# Altium schematic sheet I2C Multiplexer.SchDoc: I2C Multiplexer
size 292 x 193 mm; DocumentNumber: 50; SheetNumber: 39; SheetTotal: 44
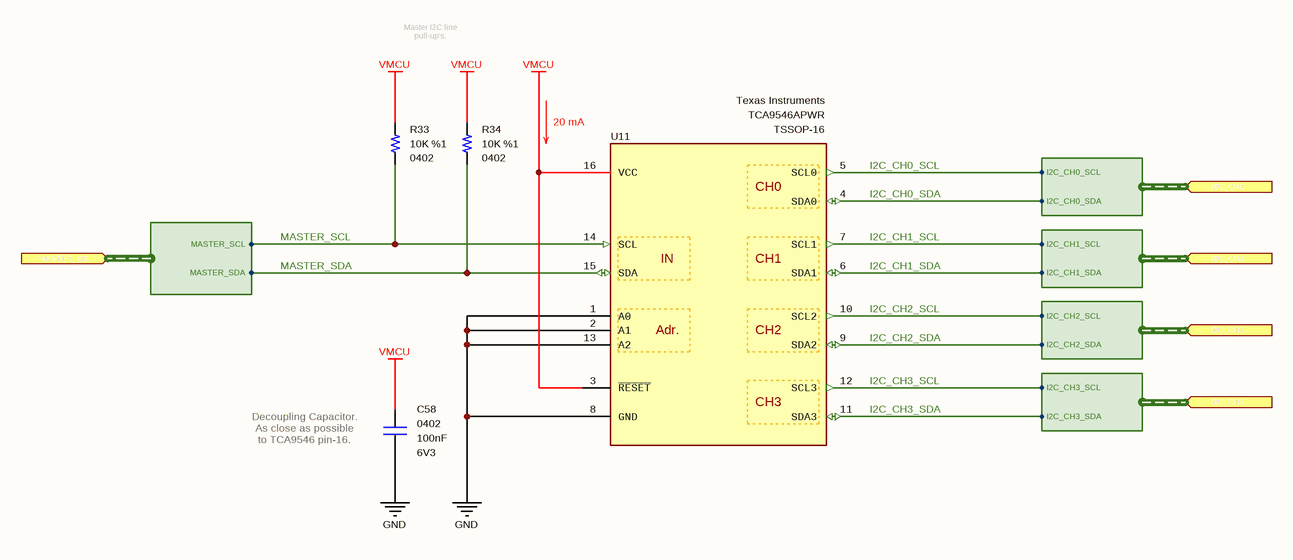
[diagram p0: I2C Multiplexer.SchDoc]

## Parts
C58  value 100nF  Case: 0402  Voltage: 6V3  [CAPACITOR_0402]  (hidden comment: Multilayer Ceramic Capacitor)
R33  value 10K  Tolerance: %1  Case: 0402  [RESISTOR_0402]  (hidden comment: Thick Film Resistor)
R34  value 10K  Tolerance: %1  Case: 0402  [RESISTOR_0402]  (hidden comment: Thick Film Resistor)
U11  Manufacturer Part Number: TCA9546APWR  Manufacturer Name: Texas Instruments  [TSSOP-16]  (hidden comment: I2C Switch IC)

## Ports
I2C_CH0 (in, harness I2C_CH0), I2C_CH1 (in, harness I2C_CH1), I2C_CH2 (in, harness I2C_CH2), I2C_CH3 (in, harness I2C_CH3), MASTER_I2C (in, harness MASTER_I2C)

## Harnesses
MASTER_I2C: MASTER_SDA, MASTER_SCL
I2C_CH0: I2C_CH0_SCL, I2C_CH0_SDA
I2C_CH1: I2C_CH1_SCL, I2C_CH1_SDA
I2C_CH2: I2C_CH2_SCL, I2C_CH2_SDA
I2C_CH3: I2C_CH3_SCL, I2C_CH3_SDA

## Nets
GND: C58.1 U11.1(A0) U11.2(A1) U11.8(GND) U11.13(A2)
VMCU: C58.2 R33.2 R34.2 U11.3(~{RESET}) U11.16(VCC)
I2C_CH0_SCL: U11.5(SCL0) ; port I2C_CH0.I2C_CH0_SCL
I2C_CH0_SDA: U11.4(SDA0) ; port I2C_CH0.I2C_CH0_SDA
I2C_CH1_SCL: U11.7(SCL1) ; port I2C_CH1.I2C_CH1_SCL
I2C_CH1_SDA: U11.6(SDA1) ; port I2C_CH1.I2C_CH1_SDA
I2C_CH2_SCL: U11.10(SCL2) ; port I2C_CH2.I2C_CH2_SCL
I2C_CH2_SDA: U11.9(SDA2) ; port I2C_CH2.I2C_CH2_SDA
I2C_CH3_SCL: U11.12(SCL3) ; port I2C_CH3.I2C_CH3_SCL
I2C_CH3_SDA: U11.11(SDA3) ; port I2C_CH3.I2C_CH3_SDA
MASTER_SCL: R33.1 U11.14(SCL) ; port MASTER_I2C.MASTER_SCL
MASTER_SDA: R34.1 U11.15(SDA) ; port MASTER_I2C.MASTER_SDA

## Notes on the sheet
- Master I2C line pull-up's.
- (near U11) 20 mA
- (near C58) Decoupling Capacitor. As close as possible to TCA9546 pin-16.
- © 2021 All rights reserved.
  This document may not, in whole or in part, be copied, photocopied, reproduced, translated or converted to any electronic or machine readable from without prior written permission of Mehmet Günce Akkoyun.
  Engineer contact : akkoyun@me.com
- Property of
- Engineer :
- Date :
- Size :
- A4
- Time :
- Project :
- Page :
- /
- Customer :
- Product ID :
- Module ID :
- Version :
- File :
- Revision :
- (in symbol IC - TCA9546APWR) CH0; IN; CH1; Adr.; CH2; CH3

## Library data of the parts
C58 = Capacitor - 100nF [0402-6V3]: Capacitor - 100nF [0402-6V3] (Ceramic); Manufacturer Name: AVX; Manufacturer Part Number: 04026D104KAT4A; Dielectric: X5R; Tolerance: %10; Height: 0.25mm; ComponentLink1Description: Mouser; ComponentLink1URL: https://www.mouser.com.tr/ProductDetail/AVX/04026D104KAT4A?qs=sGAEpiMZZMs0AnBnWHyRQPg4iYkCw7IMED%2F4kpqgf7w%3D; ComponentLink2Description: DataSheet; ComponentLink2URL: https://www.mouser.com.tr/datasheet/2/40/cx5r-776519.pdf; ROHS: Yes; Maximum Operating Temperature: +85; Minimum Operating Temperature: -55; Supplier 1: Avnet; Supplier Part Number 1: 04026D104KAT4A; Mouser Part Number: 581-04026D104KAT4A
R33 R34 = Resistor - 10K: Thick Film Resistors - SMD 1/16 W 10 Kohms 1%; Manufacturer Name: Vishay; Manufacturer Part Number: CRCW040210K0FKED; Height: 0.4mm; ComponentLink1Description: DataSheet; ComponentLink1URL: https://www.mouser.com.tr/datasheet/2/427/dcrcwe3-1762152.pdf; ComponentLink2Description: Mouser; ComponentLink2URL: https://www.mouser.com.tr/ProductDetail/Vishay-Dale/CRCW040210K0FKED?qs=sGAEpiMZZMu61qfTUdNhG2DpbjADlD3GcalbOv9utCY%3D; Supplier 1: Mouser; Supplier 2: Digi-Key; Supplier Part Number 1: 71-CRCW040210K0FKEDH; Supplier Part Number 2: 541-10.0KYCT-ND; Mouser Part Number: 71-CRCW0402-10K-E3
U11 = IC - TCA9546APWR: Switch ICs - Various 4-Channel I2C and SMBus; Mouser Part Number: 595-TCA9546APWR; ComponentLink1Description: DataSheet; ComponentLink1URL: http://www.ti.com/lit/ds/symlink/tca9546a.pdf; ComponentLink2Description: Mouser; ComponentLink2URL: https://eu.mouser.com/ProductDetail/Texas-Instruments/TCA9546APWR?qs=sGAEpiMZZMu0f%252BT2bkVfuqY85%252BzcFu6eZaMCXRqwDMg%3D; Minimum Operating Temperature: -40; Maximum Operating Temperature: +85; Supplier 1: Mouser; Supplier 2: Farnell; Supplier 3: Newark; Supplier 4: Digi-Key; Supplier Part Number 1: 595-TCA9546APWR; Supplier Part Number 2: 3006768; Supplier Part Number 3: 28AH5268; Supplier Part Number 4: 296-40578-1-ND; Case: TSSOP-16